# Altium schematic sheet Sheet4.SchDoc
size A4
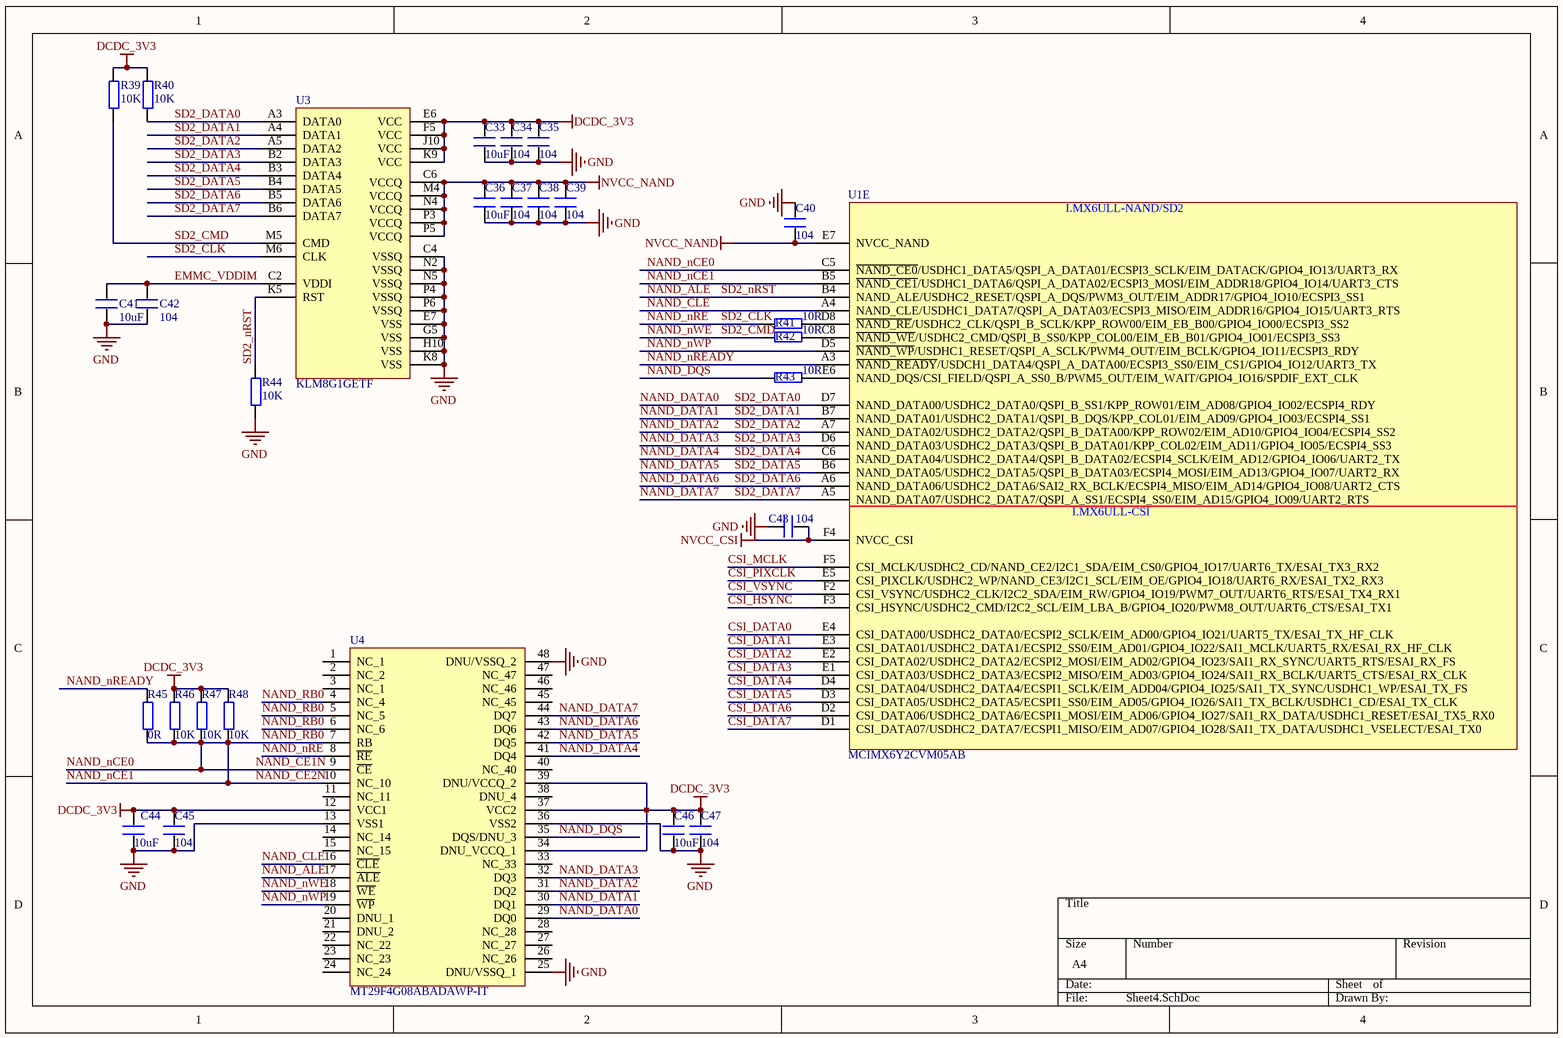
[diagram p0: Sheet4.SchDoc]

## Parts
C33  10uF  [C 0402]
C34  104  [C 0402]
C35  104  [C 0402]
C36  10uF  [C 0402]
C37  104  [C 0402]
C38  104  [C 0402]
C39  104  [C 0402]
C40  104  [C 0402]
C41  10uF  [C 0402]
C42  104  [C 0402]
C43  104  [C 0402]
C44  10uF  [C 0402]
C45  104  [C 0402]
C46  10uF  [C 0402]
C47  104  [C 0402]
R39  10K  [R 0402]
R40  10K  [R 0402]
R41  10R  [R 0402]
R42  10R  [R 0402]
R43  10R  [R 0402]
R44  10K  [R 0402]
R45  0R  [R 0402]
R46  10K  [R 0402]
R47  10K  [R 0402]
R48  10K  [R 0402]
U1  MCIMX6Y2CVM05AB  [BGA289C80P17X17_1400X1400X132]  (part E of 5)
U3  KLM8G1GETF  [BGA169  EMMC]
U4  MT29F4G08ABADAWP-IT  [TSOP48]

## Nets
DCDC_3V3: C33.2 C34.2 C35.2 C44.2 C45.2 C46.2 C47.2 R39.2 R40.2 R46.2 R47.2 R48.2 U3.E6(VCC) U3.F5(VCC) U3.J10(VCC) U3.K9(VCC) U4.12(VCC1) U4.34(DNU_VCCQ_1) U4.37(VCC2) U4.39(DNU/VCCQ_2)
GND: C33.1 C34.1 C35.1 C36.1 C37.1 C38.1 C39.1 C40.2 C41.1 C42.1 C43.2 C44.1 C45.1 C46.1 C47.1 R44.1 U3.C4(VSSQ) U3.E7(VSS) U3.G5(VSS) U3.H10(VSS) U3.K8(VSS) U3.N2(VSSQ) U3.N5(VSSQ) U3.P4(VSSQ) U3.P6(VSSQ) U4.13(VSS1) U4.25(DNU/VSSQ_1) U4.36(VSS2) U4.48(DNU/VSSQ_2)
NVCC_CSI: C43.1 U1.F4(NVCC_CSI)
NVCC_NAND: C36.2 C37.2 C38.2 C39.2 C40.1 U1.E7(NVCC_NAND) U3.C6(VCCQ) U3.M4(VCCQ) U3.N4(VCCQ) U3.P3(VCCQ) U3.P5(VCCQ)
CSI_DATA0: U1.E4(CSI_DATA00/USDHC2_DATA0/ECSPI2_SCLK/EIM_AD00/GPIO4_IO21/UART5_TX/ESAI_TX_HF_CLK)
CSI_DATA1: U1.E3(CSI_DATA01/USDHC2_DATA1/ECSPI2_SS0/EIM_AD01/GPIO4_IO22/SAI1_MCLK/UART5_RX/ESAI_RX_HF_CLK)
CSI_DATA2: U1.E2(CSI_DATA02/USDHC2_DATA2/ECSPI2_MOSI/EIM_AD02/GPIO4_IO23/SAI1_RX_SYNC/UART5_RTS/ESAI_RX_FS)
CSI_DATA3: U1.E1(CSI_DATA03/USDHC2_DATA3/ECSPI2_MISO/EIM_AD03/GPIO4_IO24/SAI1_RX_BCLK/UART5_CTS/ESAI_RX_CLK)
CSI_DATA4: U1.D4(CSI_DATA04/USDHC2_DATA4/ECSPI1_SCLK/EIM_ADD04/GPIO4_IO25/SAI1_TX_SYNC/USDHC1_WP/ESAI_TX_FS)
CSI_DATA5: U1.D3(CSI_DATA05/USDHC2_DATA5/ECSPI1_SS0/EIM_AD05/GPIO4_IO26/SAI1_TX_BCLK/USDHC1_CD/ESAI_TX_CLK)
CSI_DATA6: U1.D2(CSI_DATA06/USDHC2_DATA6/ECSPI1_MOSI/EIM_AD06/GPIO4_IO27/SAI1_RX_DATA/USDHC1_RESET/ESAI_TX5_RX0)
CSI_DATA7: U1.D1(CSI_DATA07/USDHC2_DATA7/ECSPI1_MISO/EIM_AD07/GPIO4_IO28/SAI1_TX_DATA/USDHC1_VSELECT/ESAI_TX0)
CSI_HSYNC: U1.F3(CSI_HSYNC/USDHC2_CMD/I2C2_SCL/EIM_LBA_B/GPIO4_IO20/PWM8_OUT/UART6_CTS/ESAI_TX1)
CSI_MCLK: U1.F5(CSI_MCLK/USDHC2_CD/NAND_CE2/I2C1_SDA/EIM_CS0/GPIO4_IO17/UART6_TX/ESAI_TX3_RX2)
CSI_PIXCLK: U1.E5(CSI_PIXCLK/USDHC2_WP/NAND_CE3/I2C1_SCL/EIM_OE/GPIO4_IO18/UART6_RX/ESAI_TX2_RX3)
CSI_VSYNC: U1.F2(CSI_VSYNC/USDHC2_CLK/I2C2_SDA/EIM_RW/GPIO4_IO19/PWM7_OUT/UART6_RTS/ESAI_TX4_RX1)
EMMC_VDDIM: C41.2 C42.2 U3.C2(VDDI)
NAND_ALE: R44.2 U1.B4(NAND_ALE/USDHC2_RESET/QSPI_A_DQS/PWM3_OUT/EIM_ADDR17/GPIO4_IO10/ECSPI3_SS1) U3.K5(RST) U4.17(~{ALE})  [also labelled SD2_nRST]
NAND_CE1N: R45.1 R46.1 R47.1 R48.1 U1.B5(~{NAND_CE1}/USDHC1_DATA6/QSPI_A_DATA02/ECSPI3_MOSI/EIM_ADDR18/GPIO4_IO14/UART3_CTS) U1.C5(~{NAND_CE0}/USDHC1_DATA5/QSPI_A_DATA01/ECSPI3_SCLK/EIM_DATACK/GPIO4_IO13/UART3_RX) U4.4(NC_4) U4.5(NC_5) U4.6(NC_6) U4.7(RB) U4.9(~{CE}) U4.10(NC_10)  [also labelled NAND_CE2N, NAND_nCE0, NAND_nCE1, NAND_RB0]
NAND_CLE: U1.A4(NAND_CLE/USDHC1_DATA7/QSPI_A_DATA03/ECSPI3_MISO/EIM_ADDR16/GPIO4_IO15/UART3_RTS) U4.16(~{CLE})
NAND_DATA0: R40.1 U1.D7(NAND_DATA00/USDHC2_DATA0/QSPI_B_SS1/KPP_ROW01/EIM_AD08/GPIO4_IO02/ECSPI4_RDY) U3.A3(DATA0) U4.29(DQ0)  [also labelled SD2_DATA0]
NAND_DATA1: U1.B7(NAND_DATA01/USDHC2_DATA1/QSPI_B_DQS/KPP_COL01/EIM_AD09/GPIO4_IO03/ECSPI4_SS1) U3.A4(DATA1) U4.30(DQ1)  [also labelled SD2_DATA1]
NAND_DATA2: U1.A7(NAND_DATA02/USDHC2_DATA2/QSPI_B_DATA00/KPP_ROW02/EIM_AD10/GPIO4_IO04/ECSPI4_SS2) U3.A5(DATA2) U4.31(DQ2)  [also labelled SD2_DATA2]
NAND_DATA3: U1.D6(NAND_DATA03/USDHC2_DATA3/QSPI_B_DATA01/KPP_COL02/EIM_AD11/GPIO4_IO05/ECSPI4_SS3) U3.B2(DATA3) U4.32(DQ3)  [also labelled SD2_DATA3]
NAND_DATA4: U1.C6(NAND_DATA04/USDHC2_DATA4/QSPI_B_DATA02/ECSPI4_SCLK/EIM_AD12/GPIO4_IO06/UART2_TX) U3.B3(DATA4) U4.41(DQ4)  [also labelled SD2_DATA4]
NAND_DATA5: U1.B6(NAND_DATA05/USDHC2_DATA5/QSPI_B_DATA03/ECSPI4_MOSI/EIM_AD13/GPIO4_IO07/UART2_RX) U3.B4(DATA5) U4.42(DQ5)  [also labelled SD2_DATA5]
NAND_DATA6: U1.A6(NAND_DATA06/USDHC2_DATA6/SAI2_RX_BCLK/ECSPI4_MISO/EIM_AD14/GPIO4_IO08/UART2_CTS) U3.B5(DATA6) U4.43(DQ6)  [also labelled SD2_DATA6]
NAND_DATA7: U1.A5(NAND_DATA07/USDHC2_DATA7/QSPI_A_SS1/ECSPI4_SS0/EIM_AD15/GPIO4_IO09/UART2_RTS) U3.B6(DATA7) U4.44(DQ7)  [also labelled SD2_DATA7]
NAND_DQS: R43.2 U4.35(DQS/DNU_3)
NAND_nRE: R41.2 U3.M6(CLK) U4.8(~{RE})  [also labelled SD2_CLK]
NAND_nREADY: R45.2 U1.A3(~{NAND_READY}/USDCH1_DATA4/QSPI_A_DATA00/ECSPI3_SS0/EIM_CS1/GPIO4_IO12/UART3_TX)
NAND_nWE: R39.1 R42.2 U3.M5(CMD) U4.18(~{WE})  [also labelled SD2_CMD]
NAND_nWP: U1.D5(~{NAND_WP}/USDHC1_RESET/QSPI_A_SCLK/PWM4_OUT/EIM_BCLK/GPIO4_IO11/ECSPI3_RDY) U4.19(~{WP})
NetR41_1: R41.1 U1.D8(~{NAND_RE}/USDHC2_CLK/QSPI_B_SCLK/KPP_ROW00/EIM_EB_B00/GPIO4_IO00/ECSPI3_SS2)
NetR42_1: R42.1 U1.C8(~{NAND_WE}/USDHC2_CMD/QSPI_B_SS0/KPP_COL00/EIM_EB_B01/GPIO4_IO01/ECSPI3_SS3)
NetR43_1: R43.1 U1.E6(NAND_DQS/CSI_FIELD/QSPI_A_SS0_B/PWM5_OUT/EIM_WAIT/GPIO4_IO16/SPDIF_EXT_CLK)

Not connected (* = marked no-connect by the designer): U4 1(NC_1) 2(NC_2) 3(NC_1) 11(NC_11) 14(NC_14) 15(NC_15) 20(DNU_1) 21(DNU_2) 22(NC_22) 23(NC_23) 24(NC_24) 26(NC_26) 27(NC_27) 28(NC_28) 33(NC_33) 38(DNU_4) 40(NC_40) 45(NC_45) 46(NC_46) 47(NC_47)

## Notes on the sheet
- (in symbol MCIMX6Y2CVM05AB, part E) I.MX6ULL-NAND/SD2; I.MX6ULL-CSI

## Library data of the parts
C33-C47 = C
R39-R48 = R
U3 = THGBM4G5D1HBAIR/4GB
U4 = MT29F16G16G08CBACA